# Altium schematic sheet GPS.SchDoc
size A4; SheetNumber: 3; SheetTotal: 3
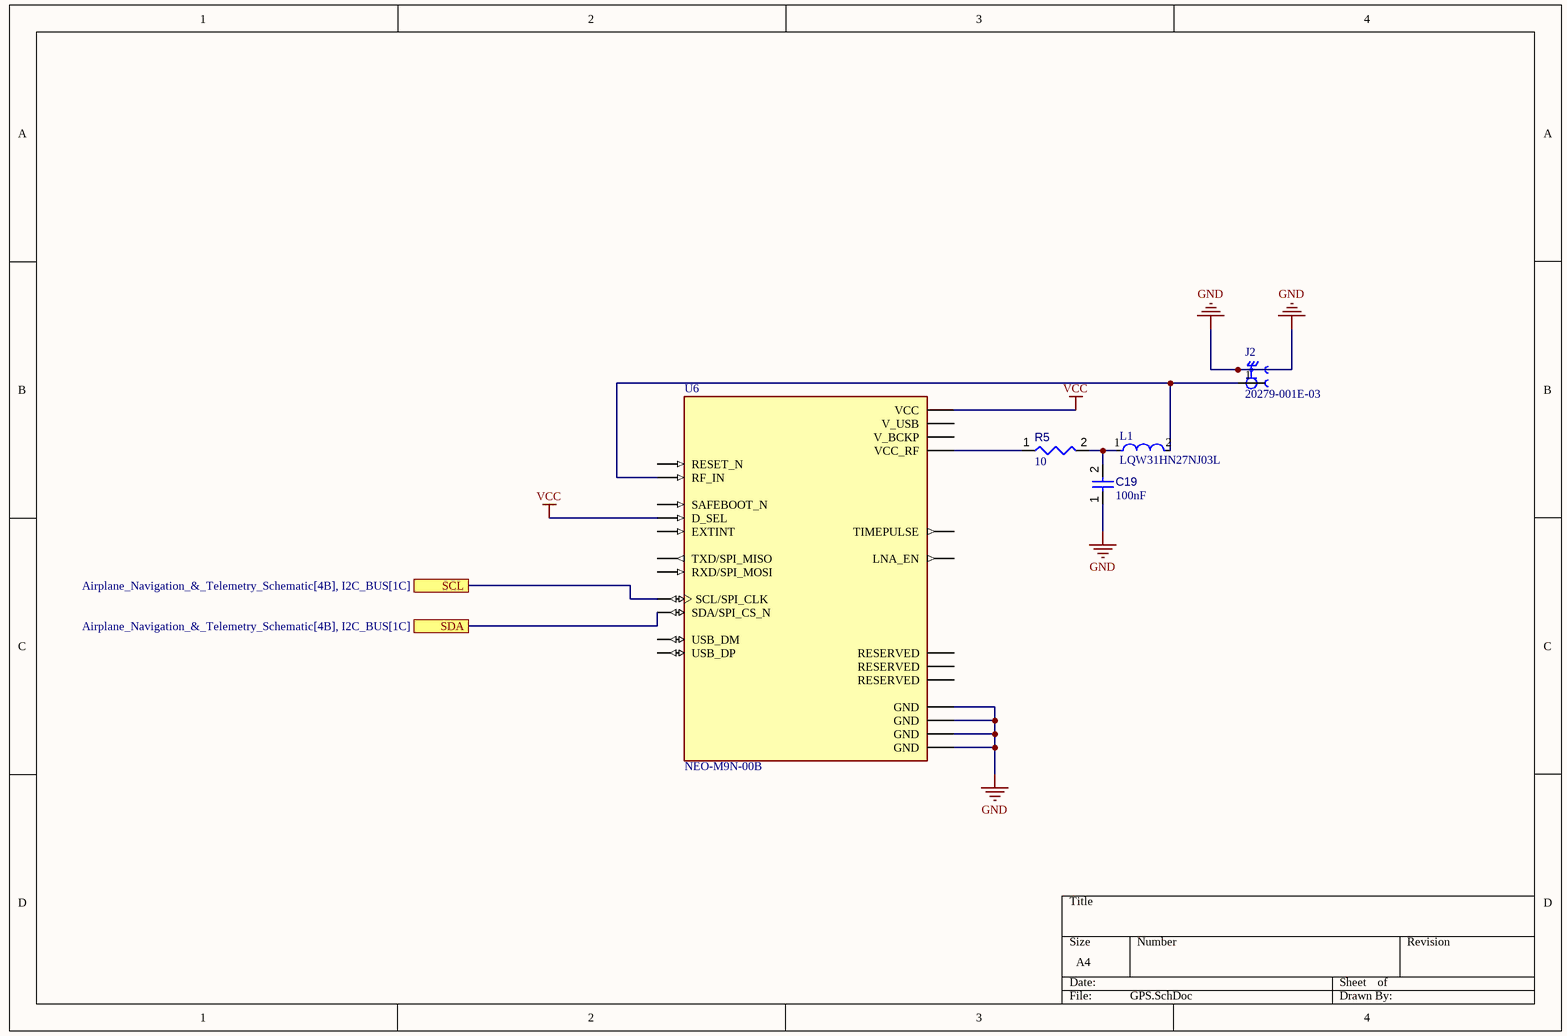
[diagram p0: GPS.SchDoc]

## Parts
C19  value 100nF  [CAPC1608X90X40NL10T20]  (hidden comment: Capacitor 100 nF +/-10% 50 V 0603)
J2  20279-001E-03  [IPEX_20279-001E-03]
L1  LQW31HN27NJ03L  [FP-LQW31HN_03-MFG]
R5  value 10  [RESC0402(1005)_L]  (hidden comment: Resistor 10R  +/-1 % 0402 63 mW)
U6  NEO-M9N-00B  [XCVR_NEO-M9N-00B]

## Ports
SCL (see Airplane_Navigation_&_Telemetry_Schematic[4B], I2C_BUS[1C]), SDA (see Airplane_Navigation_&_Telemetry_Schematic[4B], I2C_BUS[1C])

## Nets
GND: C19.1 J2.2(GROUND) J2.3(GROUND) U6.10(GND) U6.12(GND) U6.13(GND) U6.24(GND)
VCC: U6.2(D_SEL) U6.23(VCC)
SCL: U6.19(SCL/SPI_CLK) ; port SCL
SDA: U6.18(SDA/SPI_CS_N) ; port SDA
NetC19_2: C19.2 L1.1 R5.2
NetJ2_1: J2.1(SIGNAL) L1.2 U6.11(RF_IN)
NetR5_1: R5.1 U6.9(VCC_RF)

Not connected (* = marked no-connect by the designer): U6 1(SAFEBOOT_N) 3(TIMEPULSE) 4(EXTINT) 5(USB_DM) 6(USB_DP) 7(V_USB) 8(RESET_N) 14(LNA_EN) 15(RESERVED) 16(RESERVED) 17(RESERVED) 20(TXD/SPI_MISO) 21(RXD/SPI_MOSI) 22(V_BCKP)

## Library data of the parts
C19 = CMP-001-00017-6: Chip Capacitor, 100 nF, +/- 10%, 50 V, 0603 (1608 Metric); Voltage Rating: 50V; Capacitor Type: Ceramic; Tolerance: 10%; Mounting Technology: SM; Max Operating Temperature: 125°C; RoHS Compliant: True; Pins: 2; Case/Package: 0603; Min Operating Temperature: -55°C
J2 = CMP-002-00071-1: 1 POS Vertical SMD Small form factor with big performance through 6 GHz connector,MHF, RF, micro-coaxial MHF I Receptacle; MF: I-PEX; Value: *; Check_prices: https://www.snapeda.com/parts/20279-001E-03/I-PEX/view-part/?ref=eda; Component Type: Standard; Case/Package: None; MP: 20279-001E-03; Source: 20279-001E-03.SchLib; SnapEDA_Link: https://www.snapeda.com/parts/20279-001E-03/I-PEX/view-part/?ref=snap; Pins: 3; Design Item ID: 20279-001E-03
L1 = CMP-06042-006372-1: Wire Wound RF Inductor 27nH ±5% 0.0714Ω 560mA 1206; Self Resonant Frequency: 1GHz; Shielding: Unshielded; Core Material: Ferrite; Test Frequency: 100MHz; Q Factor: 60; DC Resistance (DCR): 51mR; Mount: Surface Mount; Inductance: 27nH; Max DC Current: 560mA; Military Standard: Not; Height: 1.8mm; Width: 0.063inch; Case Code (Metric): 3216; Height - Seated (Max): 0.079inch; Min Operating Temperature: -40°C; Weight: 0.000705oz; Package Quantity: 2000; Max Operating Temperature: 85°C; Current Rating: 560mA; Case Code (Imperial): 1206; Packaging: Tape and Reel; DC Current: 560mA; Termination: SMD/SMT; Depth: 1.8mm; Resistor Type: Wirewound; Radiation Hardening: No; Case/Package: 1206; Length: 3.2mm; Tolerance: 5%
R5 = CMP-009-00152-3: Chip Resistor, 10 Ohms, +/-1 %, 63 mW, -55 to 155 degC, 0402; Tolerance: 1%; Power: 63mW; Pins: 2; Max Operating Temperature: 155°C; Min Operating Temperature: -55°C; Case/Package: 0402
U6 = CMP-015-000000-1: series RF Receiver BeiDou, Galileo, GLONASS, GNSS, GPS - -167dBm - - Module; MF: u-blox; SnapEDA_Link: https://www.snapeda.com/parts/NEO-M9N-00B/u-blox/view-part/?ref=snap; MP: NEO-M9N-00B; Source: NEO-M9N-00B.SchLib; Check_prices: https://www.snapeda.com/parts/NEO-M9N-00B/u-blox/view-part/?ref=eda; Value: *; Package: SMD-24 u-blox; Design Item ID: NEO-M9N-00B; Pin Count: 24; Component Type: Standard